# EAGLE design ican (EAGLE 9.6.1)
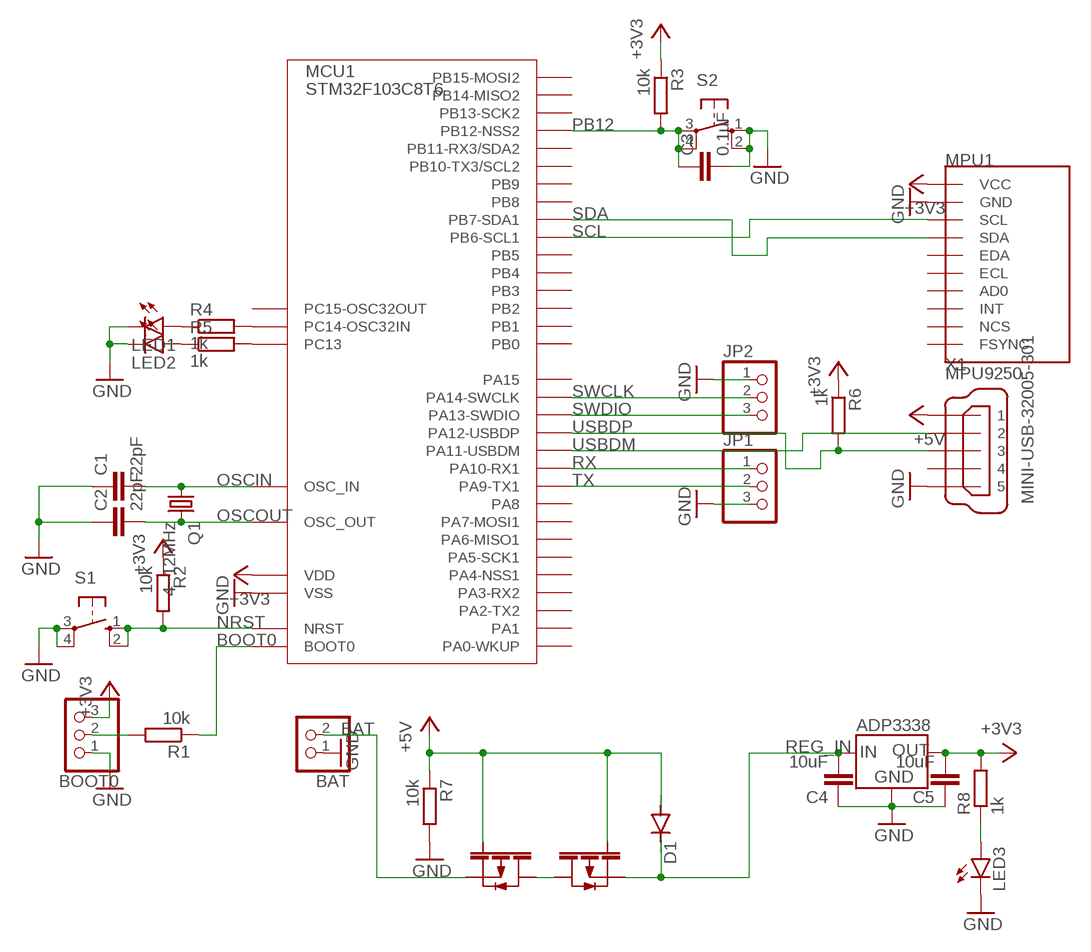
[diagram p0: schematic, sheet 1]

## Parts
BAT  PINHD-1X2  [1X02]
BOOT0  PINHD-1X3  [1X03]
C1  22pF  C-EUC2012  [C2012]
C2  22pF  C-EUC2012  [C2012]
C3  0.1uF  C-EUC2012  [C2012]
C4  10uF  C-EUC2012  [C2012]
C5  10uF  C-EUC2012  [C2012]
D1  DIODE-SOD123  [SOD123]
FET1  PCH  [SOT-23]
FET2  PCH  [SOT-23]
IC1  ADP3338-3.3  [SOT-223]
JP1  PINHD-1X3  [1X03]
JP2  PINHD-1X3  [1X03]
LED1  LEDCHIPLED_1206  [CHIPLED_1206]
LED2  LEDCHIPLED_1206  [CHIPLED_1206]
LED3  LEDCHIPLED_1206  [CHIPLED_1206]
MCU1  STM32F103C8T6  [LQFP48]
MPU1  MPU9250  [GY-9250]
Q1  4~12MHz  CRYSTALHC49S  [HC49/S]
R1  10k  R-EU_R2012  [R2012]
R2  10k  R-EU_R2012  [R2012]
R3  10k  R-EU_R2012  [R2012]
R4  1k  R-EU_R2012  [R2012]
R5  1k  R-EU_R2012  [R2012]
R6  1k  R-EU_R2012  [R2012]
R7  10k  R-EU_R2012  [R2012]
R8  1k  R-EU_R2012  [R2012]
S1  10-XX  [B3F-10XX]
S2  10-XX  [B3F-10XX]
X1  MINI-USB-32005-301  [32005-301]

## Nets
+3V3: BOOT0.3 C5.2 IC1.1(OUT) IC1.2(OUT) MCU1.1(VDD) MCU1.9(VDD) MCU1.24(VDD) MCU1.36(VDD) MCU1.48(VDD) MPU1.P1(VCC) R2.1 R3.1 R6.1 R8.2
+5V: D1.A FET1.P$1 FET2.P$1 R7.1 X1.1
BAT: BAT.2 FET1.P$2
BOOT0 [SIGNAL]: MCU1.44(BOOT0) R1.1
BOOT0_ [SIGNAL]: BOOT0.2 R1.2
GND: BAT.1 BOOT0.1 C1.1 C2.1 C3.2 C4.1 C5.1 IC1.4(GND) JP1.3 JP2.1 LED1.C LED2.C LED3.C MCU1.8(VSS) MCU1.23(VSS) MCU1.35(VSS) MCU1.47(VSS) MPU1.P2(GND) R7.2 S1.3(P) S1.4(P1) S2.1(S) S2.2(S1) X1.5
N$6: MCU1.3(PC14-OSC32IN) R4.2
N$12: MCU1.2(PC13) R5.2
N$13: LED1.A R4.1
N$14: LED2.A R5.1
N$19: FET1.P$3 FET2.P$3
N$20: LED3.A R8.1
NRST [SIGNAL]: MCU1.7(NRST) R2.2 S1.1(S) S1.2(S1)
OSCIN: C1.2 MCU1.5(OSC_IN) Q1.1
OSCOUT: C2.2 MCU1.6(OSC_OUT) Q1.2
PB12 [SIGNAL]: C3.1 MCU1.25(PB12-NSS2) R3.2 S2.3(P) S2.4(P1)
REG_IN: C4.2 D1.C FET2.P$2 IC1.3(IN)
RX [SIGNAL]: JP1.1 MCU1.31(PA10-RX1)
SCL [SIGNAL]: MCU1.42(PB6-SCL1) MPU1.P3(SCL)
SDA [SIGNAL]: MCU1.43(PB7-SDA1) MPU1.P4(SDA)
SWCLK [SIGNAL]: JP2.2 MCU1.37(PA14-SWCLK)
SWDIO [SIGNAL]: JP2.3 MCU1.34(PA13-SWDIO)
TX [SIGNAL]: JP1.2 MCU1.30(PA9-TX1)
USBDM [SIGNAL]: MCU1.32(PA11-USBDM) X1.2
USBDP [SIGNAL]: MCU1.33(PA12-USBDP) R6.2 X1.3
Unconnected: MCU1.4(PC15-OSC32OUT) MCU1.10(PA0-WKUP) MCU1.11(PA1) MCU1.12(PA2-TX2) MCU1.13(PA3-RX2) MCU1.14(PA4-NSS1) MCU1.15(PA5-SCK1) MCU1.16(PA6-MISO1) MCU1.17(PA7-MOSI1) MCU1.18(PB0) MCU1.19(PB1) MCU1.20(PB2) MCU1.21(PB10-TX3/SCL2) MCU1.22(PB11-RX3/SDA2) MCU1.26(PB13-SCK2) MCU1.27(PB14-MISO2) MCU1.28(PB15-MOSI2) MCU1.29(PA8) MCU1.38(PA15) MCU1.39(PB3) MCU1.40(PB4) MCU1.41(PB5) MCU1.45(PB8) MCU1.46(PB9) MPU1.P5(EDA) MPU1.P6(ECL) MPU1.P7(AD0) MPU1.P8(INT) MPU1.P9(NCS) MPU1.P10(FSYNC) X1.4

## Library data of the parts
BAT = pinhead:PINHD-1X2: PIN HEADER
BOOT0 JP1 JP2 = pinhead:PINHD-1X3: PIN HEADER
C1-C5 = rcl:C-EU: CAPACITOR, European symbol; SPICEPREFIX: C
D1 = diode:DIODE-: DIODE
FET1 FET2 = MOSFET:PCH
IC1 = ADP3338:ADP3338-3.3
LED1-LED3 = led:LED: LED OSRAM: - CHIPLED LG R971, LG N971, LY N971, LG Q971, LY Q971, LO R971, LY R971 LH N974, LH R974 LS Q976, LO Q976, LY Q976 LO Q996 - Hyper CHIPLED LW Q18S LB Q993, LB Q99A, LB R99A - SideLED LS A670, LO A670, LY A670, LG A670, LP A670 LB A673, LV A673, LT A673, LW A673 LH A674 LY A675 LS A676, LA A676, LO A676, LY A676, LW A676 LS A679, LY A679, LG A679 - Hyper Micro SIDELED® LS Y876, LA Y876, LO Y876, LY Y876 LT Y87S - SmartLED LW L88C, LW L88S LB L89C, LB L89S, LG L890 LS L89K, LO L89K, LY L89K LS L896, LA L896, LO L896, LY L896 - TOPLED LS T670, LO T670, LY T670, LG T670, LP T670 LSG T670, LSP T670, LSY T670, LOP T670, LYG T670 LG T671, LOG T671, LSG T671 LB T673, LV T673, LT T673, LW T673 LH T674 LS T676, LA T676, LO T676, LY T676, LB T676, LH T676, LSB T676, LW T676 LB T67C, LV T67C, LT T67C, LS T67K, LO T67K, LY T67K, LW E67C LS E67B, LA E67B, LO E67B, LY E67B, LB E67C, LV E67C, LT E67C LW T67C LS T679, LY T679, LG T679 LS T770, LO T770, LY T770, LG T770, LP T770 LB T773, LV T773, LT T773, LW T773 LH T774 LS E675, LA E675, LY E675, LS T675 LS T776, LA T776, LO T776, LY T776, LB T776 LHGB T686 LT T68C, LB T68C - Hyper Mini TOPLED® LB M676 - Mini TOPLED Santana® LG M470 LS M47K, LO M47K, LY M47K Source: http://www.osram.convergy.de LUXEON: - LUMILED® LXK2-PW12-R00, LXK2-PW12-S00, LXK2-PW14-U00, LXK2-PW14-V00 LXK2-PM12-R00, LXK2-PM12-S00, LXK2-PM14-U00 LXK2-PE12-Q00, LXK2-PE12-R00, LXK2-PE12-S00, LXK2-PE14-T00, LXK2-PE14-U00 LXK2-PB12-K00, LXK2-PB12-L00, LXK2-PB12-M00, LXK2-PB14-N00, LXK2-PB14-P00, LXK2-PB14-Q00 LXK2-PR12-L00, LXK2-PR12-M00, LXK2-PR14-Q00, LXK2-PR14-R00 LXK2-PD12-Q00, LXK2-PD12-R00, LXK2-PD12-S00 LXK2-PH12-R00, LXK2-PH12-S00 LXK2-PL12-P00, LXK2-PL12-Q00, LXK2-PL12-R00 Source: www.luxeon.com KINGBRIGHT: KA-3528ASYC Source: www.kingbright.com
MCU1 = STM32F103C8T6:STM32F103C8T6
MPU1 = MPU9250:MPU9250
Q1 = crystal:CRYSTAL: CRYSTAL; OC_FARNELL: 1667008; OC_NEWARK: unknown
R1-R8 = rcl:R-EU_: RESISTOR, European symbol; SPICEPREFIX: R
S1 S2 = switch-omron:10-XX: OMRON SWITCH; MPN: B3F-1000; OC_FARNELL: 176432; OC_NEWARK: 36M3542
X1 = con-cypressindustries:MINI-USB-: MINI USB-B Conector Source: www.cypressindustries.com; OC_FARNELL: unknown; OC_NEWARK: unknown

## Net classes
0 default: width 0.305 mm, drill 0.305 mm, clearance 0.152 mm
1 SIGNAL: width 0.229 mm, drill 0.305 mm, clearance 0.152 mm

## Board
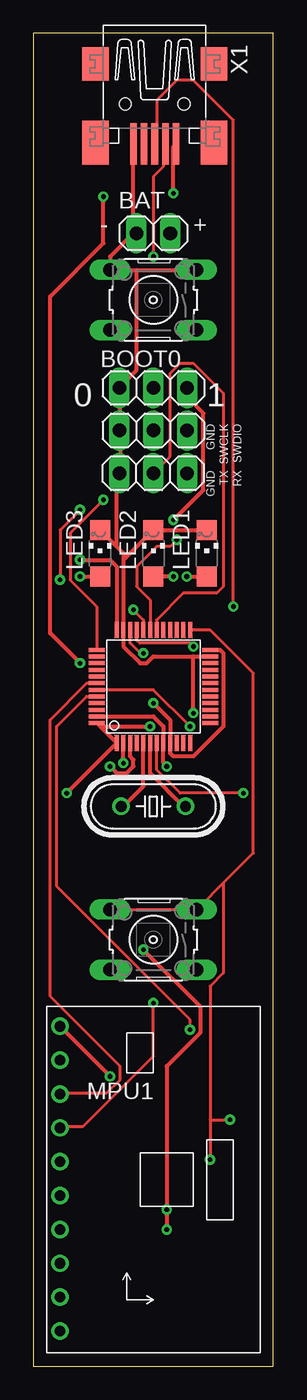
[diagram p1: board, top side]
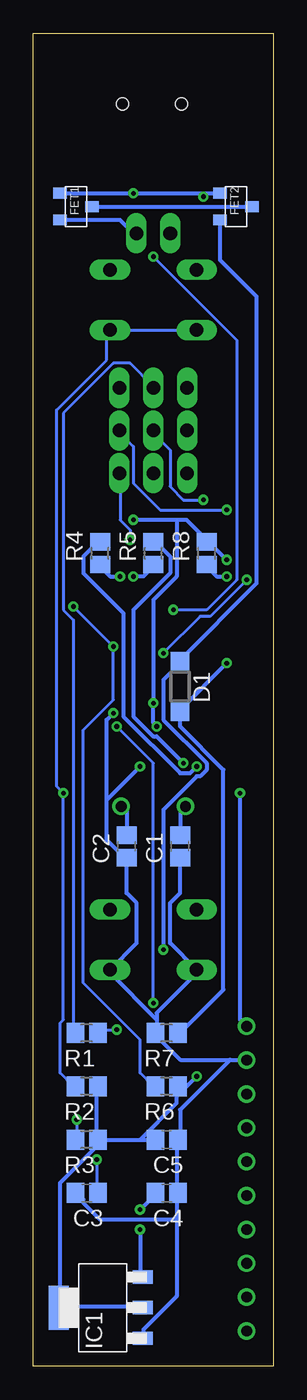
[diagram p2: board, bottom side, seen from below]

Size 18 x 100 mm. Coordinates in mm from the lower left corner, seen from the top.
Outline: 0,0 18,0 18,100 0,100 0,0
Copper layers (1*16): Top 0.035mm / dielectric 1.5mm / Bottom 0.035mm
Design rules "PCBGoGo": minimum track width 6mil, minimum drill 0.2mm, track to track 6mil, track to pad 6mil, pad to pad 6mil, via to via 6mil, smd to smd 6mil, copper to edge 0.2mm, drill to drill 6mil, minimum pad ring 10mil, minimum via ring 8mil, stop-mask expansion 4mil, vias tented up to drill 0mil, thermal gap 10mil

### Footprints (pad centres in the part's own frame; a part is rotated, then mirrored left to right if it is on the bottom)
1X02 = drill 1.016 long: 1 -1.27,0; 2 1.27,0
1X03 = drill 1.016 long: 1 -2.54,0; 2 0,0; 3 2.54,0
C2012 = smd 1.3 x 1.5: 1 -0.85,0; 2 0.85,0
SOD123 = smd 1.4 x 1.4: A 1.9,0; C -1.9,0
SOT-23 = smd 0.8 x 1: P$1 -1,0; P$2 1,0; P$3 0,2.4
SOT-223 = smd 3.3 x 1.5: 1 0,3.3 | smd 1 x 1.5: 2 0,-3; 3 2.3,-3; 4 -2.3,-3
CHIPLED_1206 = smd 1.5 x 1.5: A 0,-1.75; C 0,1.75
LQFP48 = smd 0.3 x 1.2: 1 -2.75,-4.25; 2 -2.25,-4.25; 3 -1.75,-4.25; 4 -1.25,-4.25; 5 -0.75,-4.25; 6 -0.25,-4.25; 7 0.25,-4.25; 8 0.75,-4.25; 9 1.25,-4.25; 10 1.75,-4.25; 11 2.25,-4.25; 12 2.75,-4.25; 25 2.75,4.25; 26 2.25,4.25; 27 1.75,4.25; 28 1.25,4.25; 29 0.75,4.25; 30 0.25,4.25; 31 -0.25,4.25; 32 -0.75,4.25; 33 -1.25,4.25; 34 -1.75,4.25; 35 -2.25,4.25; 36 -2.75,4.25 | smd 1.2 x 0.3: 13 4.25,-2.75; 14 4.25,-2.25; 15 4.25,-1.75; 16 4.25,-1.25; 17 4.25,-0.75; 18 4.25,-0.25; 19 4.25,0.25; 20 4.25,0.75; 21 4.25,1.25; 22 4.25,1.75; 23 4.25,2.25; 24 4.25,2.75; 37 -4.25,2.75; 38 -4.25,2.25; 39 -4.25,1.75; 40 -4.25,1.25; 41 -4.25,0.75; 42 -4.25,0.25; 43 -4.25,-0.25; 44 -4.25,-0.75; 45 -4.25,-1.25; 46 -4.25,-1.75; 47 -4.25,-2.25; 48 -4.25,-2.75
GY-9250 = drill 0.8: P1 -7,11.5; P2 -7,8.96; P3 -7,6.42; P4 -7,3.88; P5 -7,1.34; P6 -7,-1.2; P7 -7,-3.74; P8 -7,-6.28; P9 -7,-8.82; P10 -7,-11.36
HC49/S = drill 0.813: 1 -2.413,0; 2 2.413,0
R2012 = smd 1.3 x 1.5: 1 -0.85,0; 2 0.85,0
B3F-10XX = drill 1.016 long: 1 -3.251,2.261; 2 3.251,2.261; 3 -3.251,-2.261; 4 3.251,-2.261
32005-301 = smd 3.1 x 0.5: 1 3,1.6; 2 3,0.8; 3 3,0; 4 3,-0.8; 5 3,-1.6 | smd 2.5 x 2: M1 -3,-4.45; M2 -3,4.45 | smd 3.3 x 2: M3 2.9,4.45; M4 2.9,-4.45 | hole 0.9: 0,2.2; 0,-2.2

### Placement (x,y rotation side)
BAT  9,85 0 top
BOOT0  9,73.4 0 top
C1  7,39 90 bottom
C2  11,39 90 bottom
C3  14,13 180 bottom
C4  8,13 180 bottom
C5  8,17 180 bottom
D1  7,51 270 bottom
FET1  16,87 270 bottom
FET2  4,87 270 bottom
IC1  12.8,4.4 90 bottom
JP1  9,67 180 top
JP2  9,70.2 0 top
LED1  13,61 0 top
LED2  9,61 0 top
LED3  5,61 0 top
MCU1  9,51 0 top
MPU1  9,14 0 top
Q1  9,42 0 top
R1  14,25 180 bottom
R2  14,21 180 bottom
R3  14,17 180 bottom
R4  13,61 90 bottom
R5  9,61 90 bottom
R6  8,21 180 bottom
R7  8,25 180 bottom
R8  5,61 90 bottom
S1  9,80 180 top
S2  9,32 180 top
X1  9.1,94.7 270 top

### Tracks (layer width: path | path; a pad name or v marks a point on that pad's centre or on a via)
+3V3  (via drill 0.35)
  Top 0.305: MCU1.24 14,53.75 14.25,53.5 14.25,48 12,45.75 10.5,45.75 10.25,46 MCU1.9 10.25,48.5 v9,49.75 | MCU1.36 6.25,60 5.75,60.5 v3.5,60.5 | v10.5,63.5 12.75,65.75 12.75,71.5 11.75,72.5 11.75,73.25 BOOT0.3 | 5,48 MCU1.1 v2.5,43 | 5,48 MCU1.48 | v5.75,21.75 MPU1.P1 | 5,48 v8.75,48
  Bottom 0.305: 5,62 v3.5,60.5 | 7.25,63.5 6.5,63.5 5,62 | 7.25,63.5 v10.5,63.5 | 5,62 R8.2 | 7.25,63.5 7.25,59.25 9,57.5 v9,49.75 9,48.25 v8.75,48 | v2.5,43 2.5,26 MPU1.P1 | 10,17 R3.1 13.25,17 | 10,17 C5.2 | 7.25,20.25 7.25,19.75 10,17 | 7.25,20.25 7.25,21 R6.1 | 13.25,17 13.25,21 R2.1 | 16,4.5 10,4.5 IC1.2 | 13.25,17 13.25,16.5 16,13.75 16,4.5 | 16,4.5 IC1.1 | 7.25,20.25 v5.75,21.75
+5V  (via drill 0.35)
  Top 0.305: v10.5,88 10.5,91.5 X1.1 | v5.25,87.75 5.25,84.25 1.25,80.25 1.25,55 v3.5,52.75
  Bottom 0.305: FET1.P$1 v10.5,88 5.25,88 | 5.25,88 FET2.P$1 | R7.1 7,25 3.75,28.25 3.75,44.75 7,48 D1.A 7,49.25 v3.5,52.75 | v5.25,87.75 5.25,88
BAT
  Bottom 0.305: FET1.P$2 11.5,86 10.5,85 BAT.2
BOOT0  (via drill 0.35)
  Top 0.229: MCU1.44 4,50.25 1.75,48 1.75,36 11.75,26 v11.75,25.25
  Bottom 0.229: v11.75,25.25 12.75,25.25 13,25 R1.1
BOOT0_
  Bottom 0.229: R1.2 15,25 15,56 15.75,56.75 15.75,71.5 12,75.25 10.75,75.25 9,73.5 BOOT0.2
GND  (via drill 0.35)
  Top 0.305: 7.5,85 5.75,83.25 5.75,82.5 S1.4 7.75,82.25 | 7.75,82.25 S1.3 | 7.5,85 X1.5 | 7.5,85 BAT.1 | 6.75,60.5 6.75,61 6.25,61.5 | 6.75,60.5 MCU1.35 6.75,54 8,52.75 8.5,52.75 9,53.25 12,53.25 | LED3.C 6.25,61.5 | 12,53.25 MCU1.23 | 6.75,60.5 LED2.C LED1.C | 6.25,61.5 6.25,67 JP1.3 6.5,67 6.5,70 JP2.1 6.5,70.25 6.5,73.25 BOOT0.1 6.5,73.5 7.75,74.75 7.75,82.25 | MCU1.47 9,48.75 9.75,48 MCU1.8 9.75,45.25 v10,45 | v12,49 12,53.25
  Bottom 0.305: 11,38 11,35.5 10.25,34.75 10.25,31.75 S2.1 12.25,29.5 8.75,26 | 12.5,42.5 v10,45 | 12.5,42.5 12.5,39.5 11,38 | 11,38 C2.1 | 7.25,13 7.25,17 C5.1 7,17 7,19.25 3.25,23 | 7.25,13 7.25,11 | 7.25,11 7.25,5.25 9.75,2.75 9.75,2.25 IC1.4 | 7.25,13 C4.1 | 7.25,11 13,11 14.25,12.25 14.25,12.5 14.75,13 C3.2 | 8.75,26 8.75,26.5 5.75,29.5 S2.2 7.75,31.75 7.75,34.75 7,35.5 C1.1 | 8.75,26 8.75,25 R7.2 9,25 7,23 3.25,23 | 3.25,23 2,23 MPU1.P2 | v12,49 12.5,48.5 12.5,42.5
N$6  (via drill 0.35)
  Top 0.305: MCU1.3 7.25,45.75 7.5,45.5 7.5,45 7,44.5 6.25,44.5 v5.75,45
  Bottom 0.305: v5.75,45 6.25,44.5 7,44.5 11.25,48.75 11.25,56.5 14.25,59.5 14.25,60.75 13,62 R4.2
N$12  (via drill 0.35)
  Top 0.305: v6.75,45.25 MCU1.2
  Bottom 0.305: v6.75,45.25 8.75,47.25 9,47.25 10.5,48.75 10.5,56.75 7.75,59.5 7.75,60.75 9,62 R5.2
N$13  (via drill 0.35)
  Top 0.305: v11.5,59.25 LED1.A
  Bottom 0.305: v11.5,59.25 12.25,59.25 13,60 R4.1
N$14  (via drill 0.35)
  Top 0.305: v10.5,59.25 LED2.A
  Bottom 0.305: v10.5,59.25 9.75,59.25 9,60 R5.1
N$19
  Bottom 0.305: FET1.P$3 FET2.P$3
N$20  (via drill 0.35)
  Top 0.305: v3.5,59.25 LED3.A
  Bottom 0.305: v3.5,59.25 4.25,59.25 5,60 R8.1
NRST  (via drill 0.35)
  Top 0.229: MCU1.7 9.25,44.75 11,43 v15.75,43
  Bottom 0.229: S1.2 S1.1 12.5,77.5 12.5,75.5 16.25,71.75 16.25,43.5 v15.75,43 15.75,26 16,25.75 16,22 15,21 R2.2
OSCIN
  Top 0.305: MCU1.5 8.25,43.5 6.75,42 Q1.1
  Bottom 0.305: C1.2 7,41.75 6.75,42 Q1.1
OSCOUT
  Top 0.305: MCU1.6 8.75,44.5 11.25,42 Q1.2
  Bottom 0.305: C2.2 11,41.75 11.25,42 Q1.2
PB12  (via drill 0.35)
  Top 0.229: MCU1.25 13.25,55.25 16.5,52 16.5,38.5 14.25,36.25 | 14.25,36.25 12.5,34.5 S2.3 S2.4 | 13.25,18.5 13.25,28.5 14.25,29.5 14.25,36.25 | 13.25,18.5 v13.25,15.5 | 13.25,18.5 v14.75,18.5
  Bottom 0.229: v13.25,15.5 13.25,13 C3.1 | v14.75,18.5 14.75,17 R3.2
REG_IN  (via drill 0.35)
  Top 0.305: v10,10.25 v10,11.75 10,22.5 12.5,25 12.5,27 v8.25,31.25
  Bottom 0.305: v10,10.25 10,6.75 IC1.3 | v10,11.75 8.75,13 C4.2 | FET2.P$2 4,83 1.25,80.25 1.25,58.75 7,53 D1.C 7,52.75 8.25,51.5 8.25,48.5 5,45.25 5,44.75 5.5,44.25 5.75,44.25 8.25,41.75 v8.25,31.25
RX  (via drill 0.35)
  Top 0.229: MCU1.31 8.75,57.5 7.75,58.5 7.75,60 9.25,61.5 10.25,61.5 v10.75,62
  Bottom 0.229: v10.75,62 10.75,62.75 11.5,63.5 11.5,67 JP1.1
SCL
  Top 0.229: MCU1.42 4,51.25 1.25,48.5 1.25,27.75 6.5,22.5 6.5,21.5 5.5,20.5 2,20.5 MPU1.P3
SDA  (via drill 0.35)
  Top 0.229: MCU1.43 9,50.75 v11.75,48 | v9,27.25 9,23.25 3.75,18 2,18 MPU1.P4
  Bottom 0.229: v11.75,48 9,45.25 v9,27.25
SWCLK  (via drill 0.35)
  Top 0.229: MCU1.37 4.75,57 2.75,59 2.75,62.5 v5.25,65
  Bottom 0.229: v5.25,65 6.75,65 7.75,66 7.75,68.75 9,70 JP2.2
SWDIO  (via drill 0.35)
  Top 0.229: MCU1.34 7.25,54.25 8,53.5 v8.25,53.5 | v2,59 2,62.75 v3.5,64.25
  Bottom 0.229: v8.25,53.5 5.5,56.25 4.75,56.25 v2,59 | v3.5,64.25 8.5,64.25 10.5,66.25 10.5,69 11.5,70 JP2.3
TX
  Top 0.229: MCU1.30 9.25,56 11.25,58 13.75,58 14.25,58.5 14.25,73 12,75.25 11,75.25 10.25,74.5 10.25,68.25 JP1.2
USBDM  (via drill 0.35)
  Top 0.229: MCU1.32 8.25,56 v7.5,56.75 | v9,83.25 9,89.25 9.75,90 9.75,91.5 X1.2
  Bottom 0.229: v7.5,56.75 5,56.75 2.75,59 2.75,77 v9,83.25
USBDP  (via drill 0.35)
  Top 0.229: MCU1.33 7.75,54.5 8,54.25 11.75,54.25 v12,54 | v15,57 15,93.5 12,96.5 10.75,96.5 9.25,95 9.25,91.75 X1.3
  Bottom 0.229: R6.2 9,21 10,22 10,24.5 14.25,28.75 14.25,47.75 12,50 v12,54 v15,57

### Text on the board
tNames: - | + | 0 | 1 | GND | SWCLK | SWDIO | GND | TX | RX